# Altium schematic sheet Peripherals.SchDoc: Плата отладочная для выполнения лабораторных работ
size 420 x 297 mm; CheckedBy: Смирнов А. Н.; Author: Самарин И. Д.; CompanyName: МЭИ ЭР-02м-18; DrawnBy: Самарин И. Д.; Address1: Address1; Address2: Address2; Address3: Address3; Address4: Address4; DocumentNumber: МЭИ.466219.001 Э3; SheetNumber: 4; Scale: 1:1; Title2str: по курсу "Информационная электроника"; DocumentType: Схема электрическая принципиальная; FirstReferrence: АБВГ.123456.001; DocumentName: Плата отладочная для выполнения лаборторных работ по курсу "Информационная электроника"
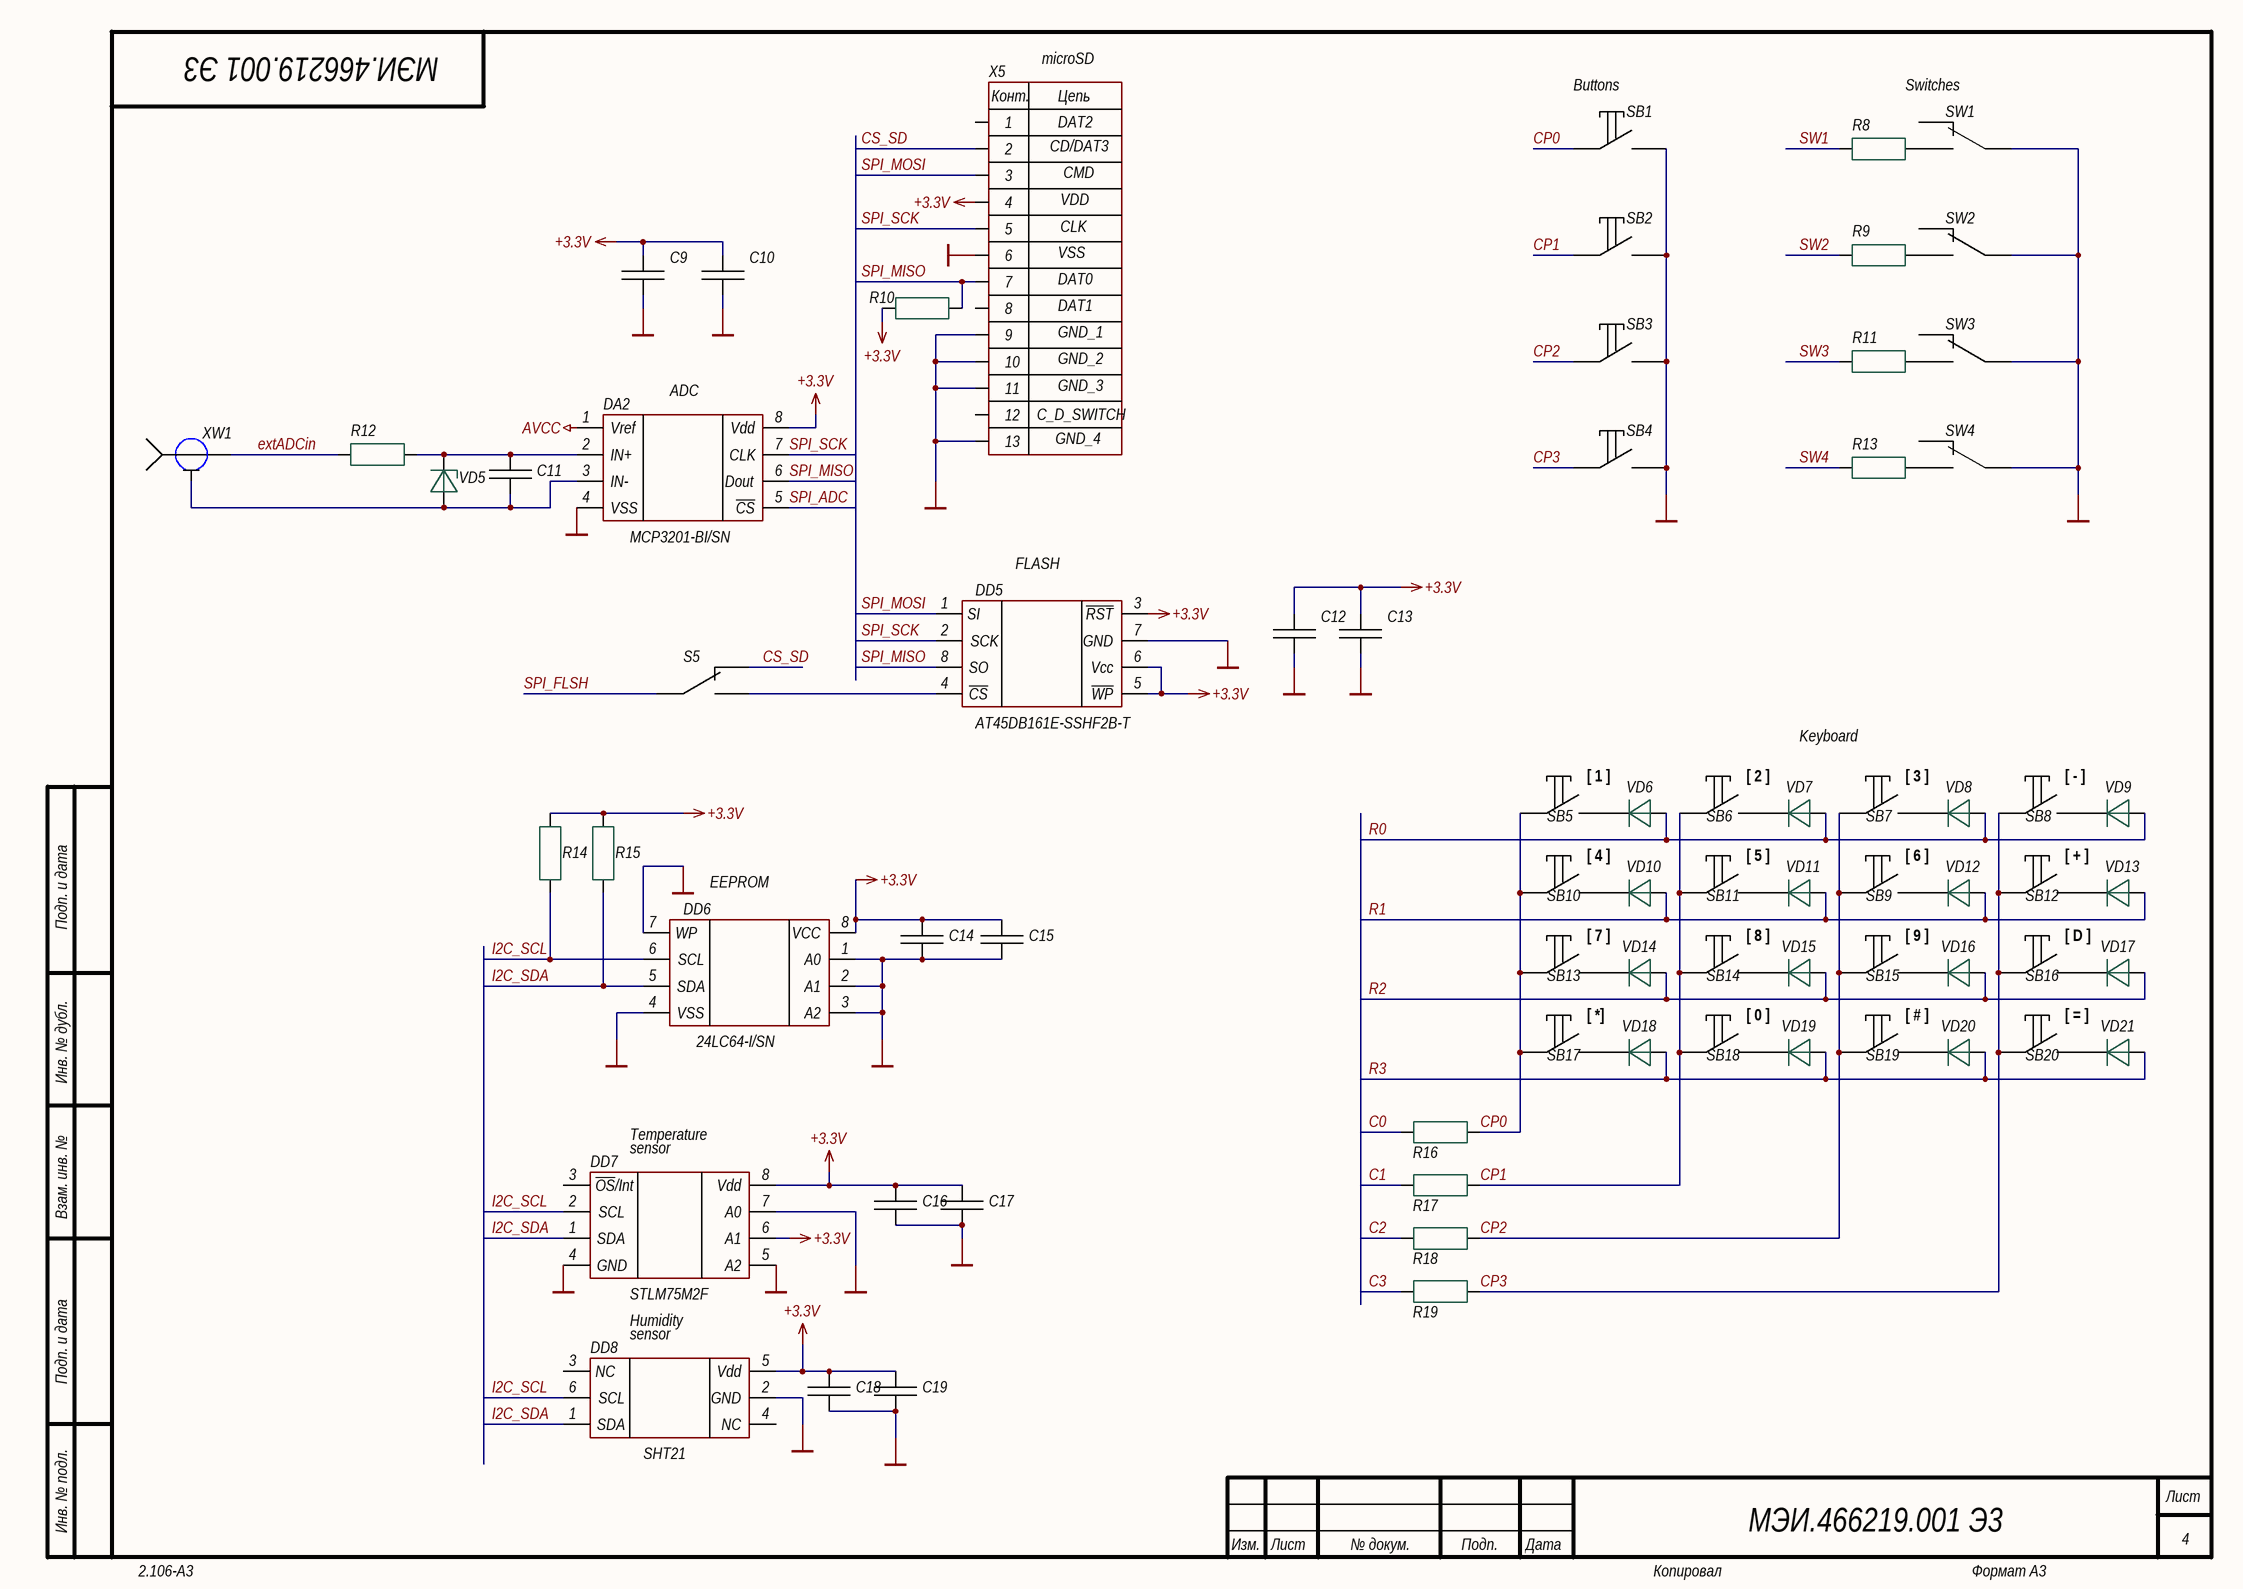
[diagram p0: Peripherals.SchDoc]

## Parts
C9  approved sub OK  [CAPC1608X90N]  (value not drawn)
C10  approved sub OK  [CAPC1608X90N]  (value not drawn)
C11  approved sub OK  [CAPC2012X135N]  (value not drawn)
C12  approved sub OK  [CAPC1608X90N]  (value not drawn)
C13  approved sub OK  [CAPC1608X90N]  (value not drawn)
C14  approved sub OK  [CAPC1608X90N]  (value not drawn)
C15  approved sub OK  [CAPC1608X90N]  (value not drawn)
C16  approved sub OK  [CAPC1608X90N]  (value not drawn)
C17  approved sub OK  [CAPC1608X90N]  (value not drawn)
C18  approved sub OK  [CAPC1608X90N]  (value not drawn)
C19  approved sub OK  [CAPC1608X90N]  (value not drawn)
DA2  MCP3201-BI/SN  [SOIC127P600X175-8AN]
DD5  AT45DB161E-SSHF2B-T  [SOIC127P600X175-8AN]
DD6  24LC64-I/SN  [SOIC127P600X175-8AN]
DD7  STLM75M2F  [SOIC127P600X175-8AN]
DD8  SHT21  [DFN-6]
R8  RC0603FR-071KL  [RESC1608X55N]  (value not drawn)
R9  RC0603FR-071KL  [RESC1608X55N]  (value not drawn)
R10  Thick Film  [RESC1608X55N]  (value not drawn)
R11  RC0603FR-071KL  [RESC1608X55N]  (value not drawn)
R12  RC0603FR-071KL  [RESC1608X55N]  (value not drawn)
R13  RC0603FR-071KL  [RESC1608X55N]  (value not drawn)
R14  Thick Film  [RESC1608X55N]  (value not drawn)
R15  Thick Film  [RESC1608X55N]  (value not drawn)
R16  RC0603FR-071KL  [RESC1608X55N]  (value not drawn)
R17  RC0603FR-071KL  [RESC1608X55N]  (value not drawn)
R18  RC0603FR-071KL  [RESC1608X55N]  (value not drawn)
R19  RC0603FR-071KL  [RESC1608X55N]  (value not drawn)
S5  ON-ON  [SWITCH_SPDT_SLIDER]  (value not drawn)
SB1  SW_THT_PB_4.3mm  [TACT-SWITCH-3-1825910-5]  (value not drawn)
SB2  SW_THT_PB_4.3mm  [TACT-SWITCH-3-1825910-5]  (value not drawn)
SB3  SW_THT_PB_4.3mm  [TACT-SWITCH-3-1825910-5]  (value not drawn)
SB4  SW_THT_PB_4.3mm  [TACT-SWITCH-3-1825910-5]  (value not drawn)
SB5  SW_THT_PB_4.3mm  [TACT-SWITCH-3-1825910-5]  (value not drawn)
SB6  SW_THT_PB_4.3mm  [TACT-SWITCH-3-1825910-5]  (value not drawn)
SB7  SW_THT_PB_4.3mm  [TACT-SWITCH-3-1825910-5]  (value not drawn)
SB8  SW_THT_PB_4.3mm  [TACT-SWITCH-3-1825910-5]  (value not drawn)
SB9  SW_THT_PB_4.3mm  [TACT-SWITCH-3-1825910-5]  (value not drawn)
SB10  SW_THT_PB_4.3mm  [TACT-SWITCH-3-1825910-5]  (value not drawn)
SB11  SW_THT_PB_4.3mm  [TACT-SWITCH-3-1825910-5]  (value not drawn)
SB12  SW_THT_PB_4.3mm  [TACT-SWITCH-3-1825910-5]  (value not drawn)
SB13  SW_THT_PB_4.3mm  [TACT-SWITCH-3-1825910-5]  (value not drawn)
SB14  SW_THT_PB_4.3mm  [TACT-SWITCH-3-1825910-5]  (value not drawn)
SB15  SW_THT_PB_4.3mm  [TACT-SWITCH-3-1825910-5]  (value not drawn)
SB16  SW_THT_PB_4.3mm  [TACT-SWITCH-3-1825910-5]  (value not drawn)
SB17  SW_THT_PB_4.3mm  [TACT-SWITCH-3-1825910-5]  (value not drawn)
SB18  SW_THT_PB_4.3mm  [TACT-SWITCH-3-1825910-5]  (value not drawn)
SB19  SW_THT_PB_4.3mm  [TACT-SWITCH-3-1825910-5]  (value not drawn)
SB20  SW_THT_PB_4.3mm  [TACT-SWITCH-3-1825910-5]  (value not drawn)
SW1  ON-ON  [SWITCH_SPDT_SLIDER]  (value not drawn)
SW2  ON-ON  [SWITCH_SPDT_SLIDER]  (value not drawn)
SW3  ON-ON  [SWITCH_SPDT_SLIDER]  (value not drawn)
SW4  ON-ON  [SWITCH_SPDT_SLIDER]  (value not drawn)
VD5  4V  [SOD323]  (value not drawn)
VD6  1N4148  [SOD523F]  (value not drawn)
VD7  1N4148  [SOD523F]  (value not drawn)
VD8  1N4148  [SOD523F]  (value not drawn)
VD9  1N4148  [SOD523F]  (value not drawn)
VD10  1N4148  [SOD523F]  (value not drawn)
VD11  1N4148  [SOD523F]  (value not drawn)
VD12  1N4148  [SOD523F]  (value not drawn)
VD13  1N4148  [SOD523F]  (value not drawn)
VD14  1N4148  [SOD523F]  (value not drawn)
VD15  1N4148  [SOD523F]  (value not drawn)
VD16  1N4148  [SOD523F]  (value not drawn)
VD17  1N4148  [SOD523F]  (value not drawn)
VD18  1N4148  [SOD523F]  (value not drawn)
VD19  1N4148  [SOD523F]  (value not drawn)
VD20  1N4148  [SOD523F]  (value not drawn)
VD21  1N4148  [SOD523F]  (value not drawn)
X5  DM3CS-SF  [DM3CS-SF]  (value not drawn)
XW1  BNC Fem. 50R  [BNC]  (value not drawn)

## Nets
+3.3V: C9.1 C10.1 C12.1 C13.1 C14.1 C15.1 C16.1 C17.1 C18.1 C19.1 DA2.8(Vdd) DD5.3(~{RST}) DD5.5(~{WP}) DD5.6(Vcc) DD6.8(VCC) DD7.6(A1) DD7.8(Vdd) DD8.5(Vdd) R10.1 R14.2 R15.2 X5.4
AVCC: DA2.1(Vref)
GND: C9.2 C10.2 C12.2 C13.2 C14.2 C15.2 C16.2 C17.2 C18.2 C19.2 DA2.4(VSS) DD5.7(GND) DD6.1(A0) DD6.2(A1) DD6.3(A2) DD6.4(VSS) DD6.7(WP) DD7.4(GND) DD7.5(A2) DD7.7(A0) DD8.2(GND) SB1.2 SB2.2 SB3.2 SB4.2 SW1.2 SW2.2 SW3.2 SW4.2 X5.6 X5.9 X5.10 X5.11 X5.13
C0: R16.1
C1: R17.1
C2: R18.1
C3: R19.1
CP0: R16.2 SB1.1 SB5.1 SB10.1 SB13.1 SB17.1
CP1: R17.2 SB2.1 SB6.1 SB11.1 SB14.1 SB18.1
CP2: R18.2 SB3.1 SB7.1 SB9.1 SB15.1 SB19.1
CP3: R19.2 SB4.1 SB8.1 SB12.1 SB16.1 SB20.1
CS_SD: S5.3 X5.2
extADCin: R12.1 XW1.Sig
I2C_SCL: DD6.6(SCL) DD7.2(SCL) DD8.6(SCL) R14.1
I2C_SDA: DD6.5(SDA) DD7.1(SDA) DD8.1(SDA) R15.1
R0: VD6.A VD7.A VD8.A VD9.A
R1: VD10.A VD11.A VD12.A VD13.A
R2: VD14.A VD15.A VD16.A VD17.A
R3: VD18.A VD19.A VD20.A VD21.A
SPI_ADC: DA2.5(~{CS})
SPI_FLSH: S5.2
SPI_MISO: DA2.6(Dout) DD5.8(SO) R10.2 X5.7
SPI_MOSI: DD5.1(SI) X5.3
SPI_SCK: DA2.7(CLK) DD5.2(SCK) X5.5
SW1: R8.1
SW2: R9.1
SW3: R11.1
SW4: R13.1
NetC11_1: C11.1 DA2.2(IN+) R12.2 VD5.K
NetC11_2: C11.2 DA2.3(IN-) VD5.A XW1.Case
NetDD5_4: DD5.4(~{CS}) S5.1
NetR8_2: R8.2 SW1.1
NetR9_2: R9.2 SW2.1
NetR11_2: R11.2 SW3.1
NetR13_2: R13.2 SW4.1
NetSB5_2: SB5.2 VD6.K
NetSB6_2: SB6.2 VD7.K
NetSB7_2: SB7.2 VD8.K
NetSB8_2: SB8.2 VD9.K
NetSB9_2: SB9.2 VD12.K
NetSB10_2: SB10.2 VD10.K
NetSB11_2: SB11.2 VD11.K
NetSB12_2: SB12.2 VD13.K
NetSB13_2: SB13.2 VD14.K
NetSB14_2: SB14.2 VD15.K
NetSB15_2: SB15.2 VD16.K
NetSB16_2: SB16.2 VD17.K
NetSB17_2: SB17.2 VD18.K
NetSB18_2: SB18.2 VD19.K
NetSB19_2: SB19.2 VD20.K
NetSB20_2: SB20.2 VD21.K

Not connected (* = marked no-connect by the designer): DD7 3(~{OS}/Int); DD8 3(NC) 4(NC); SW1 3; SW2 3; SW3 3; SW4 3; X5 1 8 12

## Notes on the sheet
- microSD
- (near SB1) Buttons
- (near SW1) Switches
- (near DA2) ADC
- (near DD5) FLASH
- [ 1 ]
- [ 2 ]
- Keyboard
- [ 3 ]
- [ - ]
- [ 4 ]
- [ 5 ]
- [ 6 ]
- [ + ]
- (near DD6) EEPROM
- [ 7 ]
- [ 8 ]
- [ 9 ]
- [ D ]
- [ *]
- [ 0 ]
- [ # ]
- [ = ]
- (near DD7) Temperature
- (near DD7) sensor
- Humidity
- (near DD8) sensor
- Подп. и дата
- Инв. № дубл.
- Взам. инв. №
- Инв. № подл.
- Изм.
- Лист
- № докум.
- Подп.
- Дата
- 2.106-A3
- Копировал
- Формат А3
- (in symbol DM3CS-SF) Конт.; Цепь; DAT2; CD/DAT3; CMD; VDD; CLK; VSS; DAT0; DAT1; GND_1; GND_2; GND_3; C_D_SWITCH; GND_4

## Library data of the parts
C9 C12 C14 C16 C18 = CAPC_100n_0603_X7R_50V_10%: Capacitor SMD Cer 100nF 10% 50V X7R 0603; Manufacturer 1: TDK Corporation; Manufacturer Part Number 1: C1608X7R1H104K; Ratings: 50V; X7R; Material: ceramic; SCDType: spec; Value: 100n; Package / Case: 0603 (1608 Metric); Tolerance: ±10%; Supplier 1: Compel; Supplier Part Number 1: *; ComponentLink1URL: https://www.compel.ru/infosheet/TDK/C1608X7R1H104KT; ComponentLink1Description: Compel; Supplier Part Number 2: *
C10 C13 C15 C17 C19 = CAPC_10u_0805_10V: Capacitor SMD Cer 10uF 10% 10V X5R 0603; Manufacturer 1: TDK Corporation; Manufacturer Part Number 1: C1608X5R1A106K080AC; Ratings: 10V; X5R; Material: ceramic; Value: 10µ; SCDType: spec; Package / Case: 0603 (1608 Metric); Tolerance: ±10%; Supplier Part Number 1: *; ComponentLink1URL: https://www.compel.ru/infosheet/TDK/C1608X5R1A106K080AC; ComponentLink1Description: Compel; Supplier 1: Compel
C11 = CAPC_330n_0805_X7R_25V_10%: Capacitor SMD Cer 330nF 10% 25V X7R 0805; Manufacturer 1: Kemet; Manufacturer Part Number 1: C0805C334K3RACTU; Ratings: 25V; X7R; Material: ceramic; SCDType: spec; Value: 330n; Package / Case: 0805 (2012 metric); Tolerance: ±10%; ComponentLink1URL: https://www.compel.ru/infosheet/KEM/C0805C334K3RACTU; ComponentLink1Description: Compel; Supplier 1: Compel; Supplier Part Number 1: *
DA2 = MCP3201: ADC; Manufacture: Microchip; HelpURL: http://ww1.microchip.com/downloads/en/devicedoc/21290f.pdf; Case: SOIC; Model: MCP3201-BI/SN; ComponentLink1URL: https://www.compel.ru/infosheet/MCRCH/MCP3201-CI%2FSN; ComponentLink1Description: Compel
DD5 = AT45DB161E: FLASH; Manufacture: Microchip; Case: SO-8 (8S1, 4.80 x 3.81); Model: AT45DB161E-SSHF2B-T; ComponentLink2URL: *; ComponentLink2Description: Datasheet; ComponentLink1Description: Compel
DD6 = 24LC64: EEPROM; Manufacture: Microchip; HelpURL: https://www.compel.ru/item-pdf/39284653603efe9197531fdb9e909a49/pn/mcrch~24aa64t-i-ot.pdf; Case: SOIJ; Model: 24LC64-I/SN
DD7 = STLM75: Temperature sensor; Manufacture: STMicro; HelpURL: https://www.compel.ru/infosheet/ST/STLM75M2F; Case: SO8; Model: STLM75M2F
DD8 = SHT21: Humidity sensor; Manufacture: SENSIRION AG; HelpURL: https://www.compel.ru/infosheet/SENSIR/SHT21; Case: DFN-6; Model: SHT21
R8 R9 R11-R13 R16-R19 = RES_1K_0603_1%: Resistor SMD chip 1k Ohm 0.1W 1% 0603; Manufacturer 1: Yageo; Ratings: 1/10W; SCDType: spec; Package / Case: 0603 (1608 Metric); Manufacturer Part Number 1: RC0603FR-071KL; Supplier 1: Compel; Supplier Part Number 1: 311-1.00KHRCT-ND; Tolerance: ±1%; Value: 1K; ComponentLink1URL: https://www.compel.ru/infosheet/YAG/RC0603FR-071KL; ComponentLink1Description: Compel
R10 = RES_10K_0603_1%: Resistor SMD chip 10k Ohm 0.1W 1% 0603; Manufacturer 1: Yageo; Manufacturer Part Number 1: RC0603FR-0710KL; Ratings: 1/10W; SCDType: spec; ComponentLink1Designator: Compel; Package / Case: 0603 (1608 Metric); Supplier 1: Compel; Supplier Part Number 1: 311-10.0KHRCT-ND; Tolerance: ±1%; Value: 10K; ComponentLink1URL: https://www.compel.ru/infosheet/YAG/RC0603FR-0710KL
R14 R15 = RES_4K7_0603_1%: Resistor SMD chip 4.7K Ohm 0.1W 1% 0603; Manufacturer Part Number 1: RC0603FR-074K7L; Manufacturer 1: Yageo; Ratings: 1/10W; SCDType: undef; Value: 4K7; ComponentLink1Designator: Compel; Package / Case: 0603 (1608 Metric); Supplier 1: Compel; Supplier Part Number 1: 311-4.70KHRCT-ND; Tolerance: ±1%; ComponentLink1URL: https://www.compel.ru/infosheet/YAG/RC0603FR-074K7L
S5 SW1-SW4 = SW_THD_SPDT_On-On: Switch THD vertical toggle SPDT; Manufacturer 1: TE Connectivity; Manufacturer Part Number 1: SLS121PC04; Contact Rating @ Voltage: 0.25A @ 125VAC; SCDType: spec; ComponentLink1Designator: Compel; Circuit: SPDT; Mounting Type: PCB mount; Supplier 1: Compel; Supplier Part Number 1: 450-1598-ND; Switch Function: On-On; ComponentLink1URL: https://www.compel.ru/infosheet/TE/SLS121PC04
SB1-SB4 SB6-SB20 = SW_THT_PB_4.3mm: Switch, tact, 4.3mm stem; Manufacturer 1: TE Connectivity; Manufacturer Part Number 1: 3-1825910-5; SCDType: spec; Function: Speed; ComponentLink1Designator: Compel; Package / Case: 6.5x6.5mm; 4.3mm stem; Material: Brass/Nylon/Ag plating; ComponentLink1URL: https://www.compel.ru/infosheet/TE/3-1825910-5
  SB6: Parameter 1: *; Parameter 2: *
SB5 = SW_THT_PB_4.3mm: Switch, tact, 4.3mm stem; Manufacturer Part Number 1: 3-1825910-5; Number: 1; SCDType: spec; Function: Speed; ComponentLink1Designator: Compel; Package / Case: 6.5x6.5mm; 4.3mm stem; Material: Brass/Nylon/Ag plating; ComponentLink1URL: https://www.compel.ru/infosheet/TE/3-1825910-5; Parameter 1: *
VD5 = DIODE_ZENER_4V_SOD323: Diode Zener SMD 4V 200mW SOD-323; Manufacturer 1: Diotec Semiconductor; Manufacturer Part Number 1: MM3Z3V6; Ratings: 4V; 0.2W;; Material: Si; Tolerance: ±3%; SCDType: source; ComponentLink1Designator: Kompel; Package / Case: SOD-323; Diode Type: Zener; Supplier 1: Kompel; Supplier Part Number 1: MM3Z3V3ST1GOSCT-ND; ComponentLink1URL: https://www.compel.ru/infosheet/DIOTEC/MM3Z3V6
VD6-VD21 = DIODE_1N4148_200mA_SOD523F: Diode SMD small signal 0.2A SOD-523F; Manufacturer 1: Fairchild Semiconductor; Manufacturer Part Number 1: 1N4148WT; Ratings: Vr=75V; Vf=1V@10mA; Io=200mA; Material: Si; SCDType: source; Package / Case: SC-79, SOD-523F; Supplier 1: Digi-Key; Supplier Part Number 1: 1N4148WTCT-ND; ComponentLink1URL: http://www.fairchildsemi.com/ds/1N/1N914BWT.pdf; ComponentLink1Description: http://www.fairchildsemi.com/ds/1N/1N914BWT.pdf; Value: 1N4148
X5 = DM3CS-SF: Connector; Manufacturer_Name: Hirose; ComponentLink1Designator: Compel; Datasheet Link: https://componentsearchengine.com/Datasheets/1/DM3CS-SF.pdf; Mouser2 Part Number: 798-DM3CSSF; Mouser2 Price/Stock: https://www.mouser.com/Search/Refine.aspx?Keyword=798-DM3CSSF; ComponentLink1URL: https://www.compel.ru/infosheet/HI/DM3CS-SF; Model: DM3CS-SF
XW1 = CONN_BNC: BNC; Manufacturer 1: TE Connectivity; Manufacturer Part Number 1: 413969-2; Impedance: 50 Ohm; Ratings: 9400pF; 1500V; SCDType: undef; Category: Connectors; Mounting Type: Through Hole; Supplier 1: Digi-Key; Supplier Part Number 1: A32418-ND; ComponentLink1URL: https://www.compel.ru/infosheet/TE/413969-2; ComponentLink1Description: Compel